# Altium schematic sheet MCU_SUPPORT_XS.SchDoc: ESU - Microcontroller Support
size B; DrawnBy: M. Seago; Organization: Gravitas; Address1: Sponsored By:; Address2: Alan Morgan; Address3: Technical Advisor:; Address4: Dr. Joseph Morgan; Revision: 1A; SheetNumber: 1; SheetTotal: 3
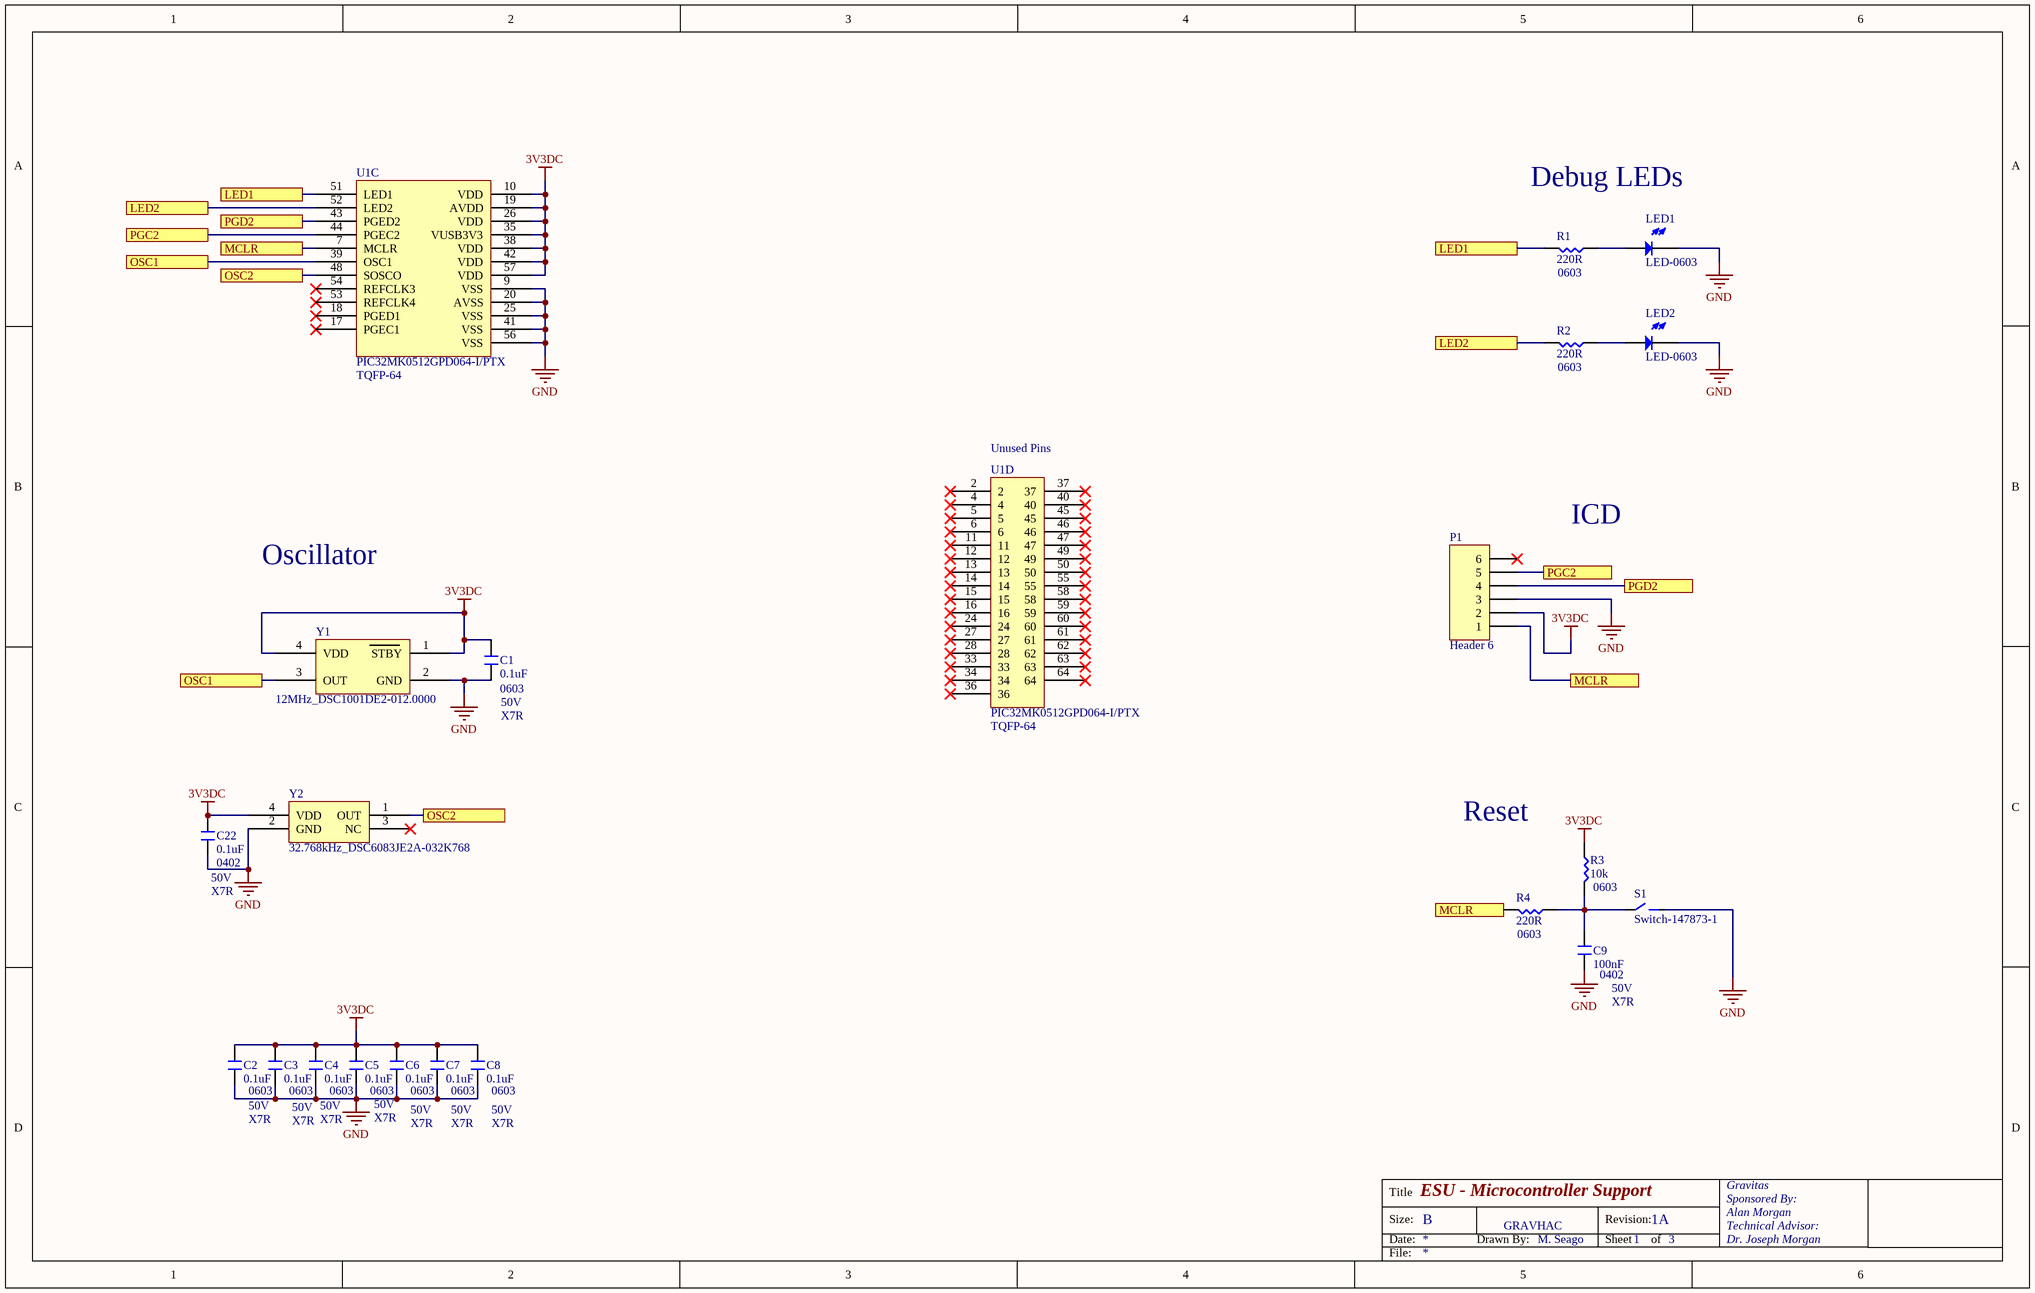
[diagram p0: MCU_SUPPORT_XS.SchDoc]

## Parts
(Parts that share a designator on the sheet are numbered #1, #2 ... from top to bottom, then left to right.)
C1  0.1uF  [NonPolar-0603]
C2  0.1uF  [NonPolar-0603]
C3  0.1uF  [NonPolar-0603]
C4  0.1uF  [NonPolar-0603]
C5  0.1uF  [NonPolar-0603]
C6  0.1uF  [NonPolar-0603]
C7  0.1uF  [NonPolar-0603]
C8  0.1uF  [NonPolar-0603]
C9  100nF  [NonPolar-0402]
C22  0.1uF  [NonPolar-0402]
LED1  LED-0603  [LED-0603]
LED2  LED-0603  [LED-0603]
P1  Header 6  [HDR1X6]
R1  220R  [NonPolar-0603]
R2  220R  [NonPolar-0603]
R3  10k  [NonPolar-0603]
R4  220R  [NonPolar-0603]
S1  Switch-147873-1  [Switch - 147873-1]
U1#1  PIC32MK0512GPD064-I/PTX  [PIC32MK0512GPD064]  (part C of 3)
U1#2  PIC32MK0512GPD064-I/PTX  [V2_PIC32MK0512GPD064IPT]  (part D of 4)
Y1  12MHz_DSC1001DE2-012.0000  [12MHz_DSC1001DE2-012.0000]
Y2  32.768kHz_DSC6083JE2A-032K768  [32.768kHz_DSC6083JE2A-032K768]

## Ports
LED1, LED2, MCLR, OSC1, OSC2, PGC2, PGD2

## Nets
3V3DC: C1.2 C2.2 C3.2 C4.2 C5.2 C6.2 C7.2 C8.2 C22.2 P1.2 R3.2 U1#1.10(VDD) U1#1.19(AVDD) U1#1.26(VDD) U1#1.35(VUSB3V3) U1#1.38(VDD) U1#1.42(VDD) U1#1.57(VDD) Y1.1(STBY) Y1.4(VDD) Y2.4(VDD)
GND: C1.1 C2.1 C3.1 C4.1 C5.1 C6.1 C7.1 C8.1 C9.1 C22.1 LED1.2 LED2.2 P1.3 S1.2 U1#1.9(VSS) U1#1.20(AVSS) U1#1.25(VSS) U1#1.41(VSS) U1#1.56(VSS) Y1.2(GND) Y2.2(GND)
LED1: R1.1 U1#1.51(LED1) ; port LED1
LED2: R2.1 U1#1.52(LED2) ; port LED2
MCLR: P1.1 R4.1 U1#1.7(MCLR) ; port MCLR
OSC1: U1#1.39(OSC1) Y1.3(OUT) ; port OSC1
OSC2: U1#1.48(SOSCO) Y2.1(OUT) ; port OSC2
PGC2: P1.5 U1#1.44(PGEC2) ; port PGC2
PGD2: P1.4 U1#1.43(PGED2) ; port PGD2
NetC9_2: C9.2 R3.1 R4.2 S1.1
NetLED1_1: LED1.1 R1.2
NetLED2_1: LED2.1 R2.2

Not connected (* = marked no-connect by the designer): P1 6*; U1#1 17(PGEC1)* 18(PGED1)* 53(REFCLK4)* 54(REFCLK3)*; U1#2 2* 4* 5* 6* 11* 12* 13* 14* 15* 16* 24* 27* 28* 33* 34* 36* 37* 40* 45* 46* 47* 49* 50* 55* 58* 59* 60* 61* 62* 63* 64*; Y2 3(NC)*

## Notes on the sheet
- Debug LEDs
- (near R1) 0603
- (near R2) 0603
- (near U1#1) TQFP-64
- (near U1#2) Unused Pins
- Oscillator
- ICD
- (near C1) 0603
- (near C1) 50V
- (near C1) X7R
- (near U1#2) TQFP-64
- Reset
- (near C22) 50V
- (near C22) X7R
- (near C22) 0402
- (near R3) 0603
- (near R4) 0603
- (near C9) 0402
- (near C9) 50V
- (near C9) X7R
- 0603
- 50V
- (near C8) 0603
- (near C8) 50V
- X7R
- GRAVHAC
- Title
- Size:
- Date:
- B
- Drawn By:
- Revision:
- Sheet
- of
- File:

## Library data of the parts
C1-C8 = Cap - 0603
C9 C22 = Cap - 0402
P1 = Header 6: Header, 6-Pin; LatestRevisionDate: 17-Jul-2002; LatestRevisionNote: Re-released for DXP Platform.; Publisher: Altium Limited
R1 = Res - 0603: 0603; Parameter 1: 0603
R2-R4 = Res - 0603